# Altium project MB1361.PrjPcb (part 2 of 3)

## Sheet ST_LINK_V2-1.SchDoc: ST_LINK_V2-1
size A3; Date: Not used; ApprovedBy: Not used; CheckedBy: Not used; Author: Not used; CompanyName: STMicroelectronics; DrawnBy: Not used; Engineer: Not used; Organization: Not used; Address1: Not used; Address2: Not used; Address3: Not used; Address4: Not used; DocumentNumber: 8; Revision: Not used; SheetNumber: 8; SheetTotal: 9; CurrentTime: Not used; CurrentDate: Not used; Time: Not used; DocumentFullPathAndName: Not used; DocumentName: Not used; ModifiedDate: Not used; ImagePath: Not used; ProjectName: Not used; Application_BuildNumber: Not used
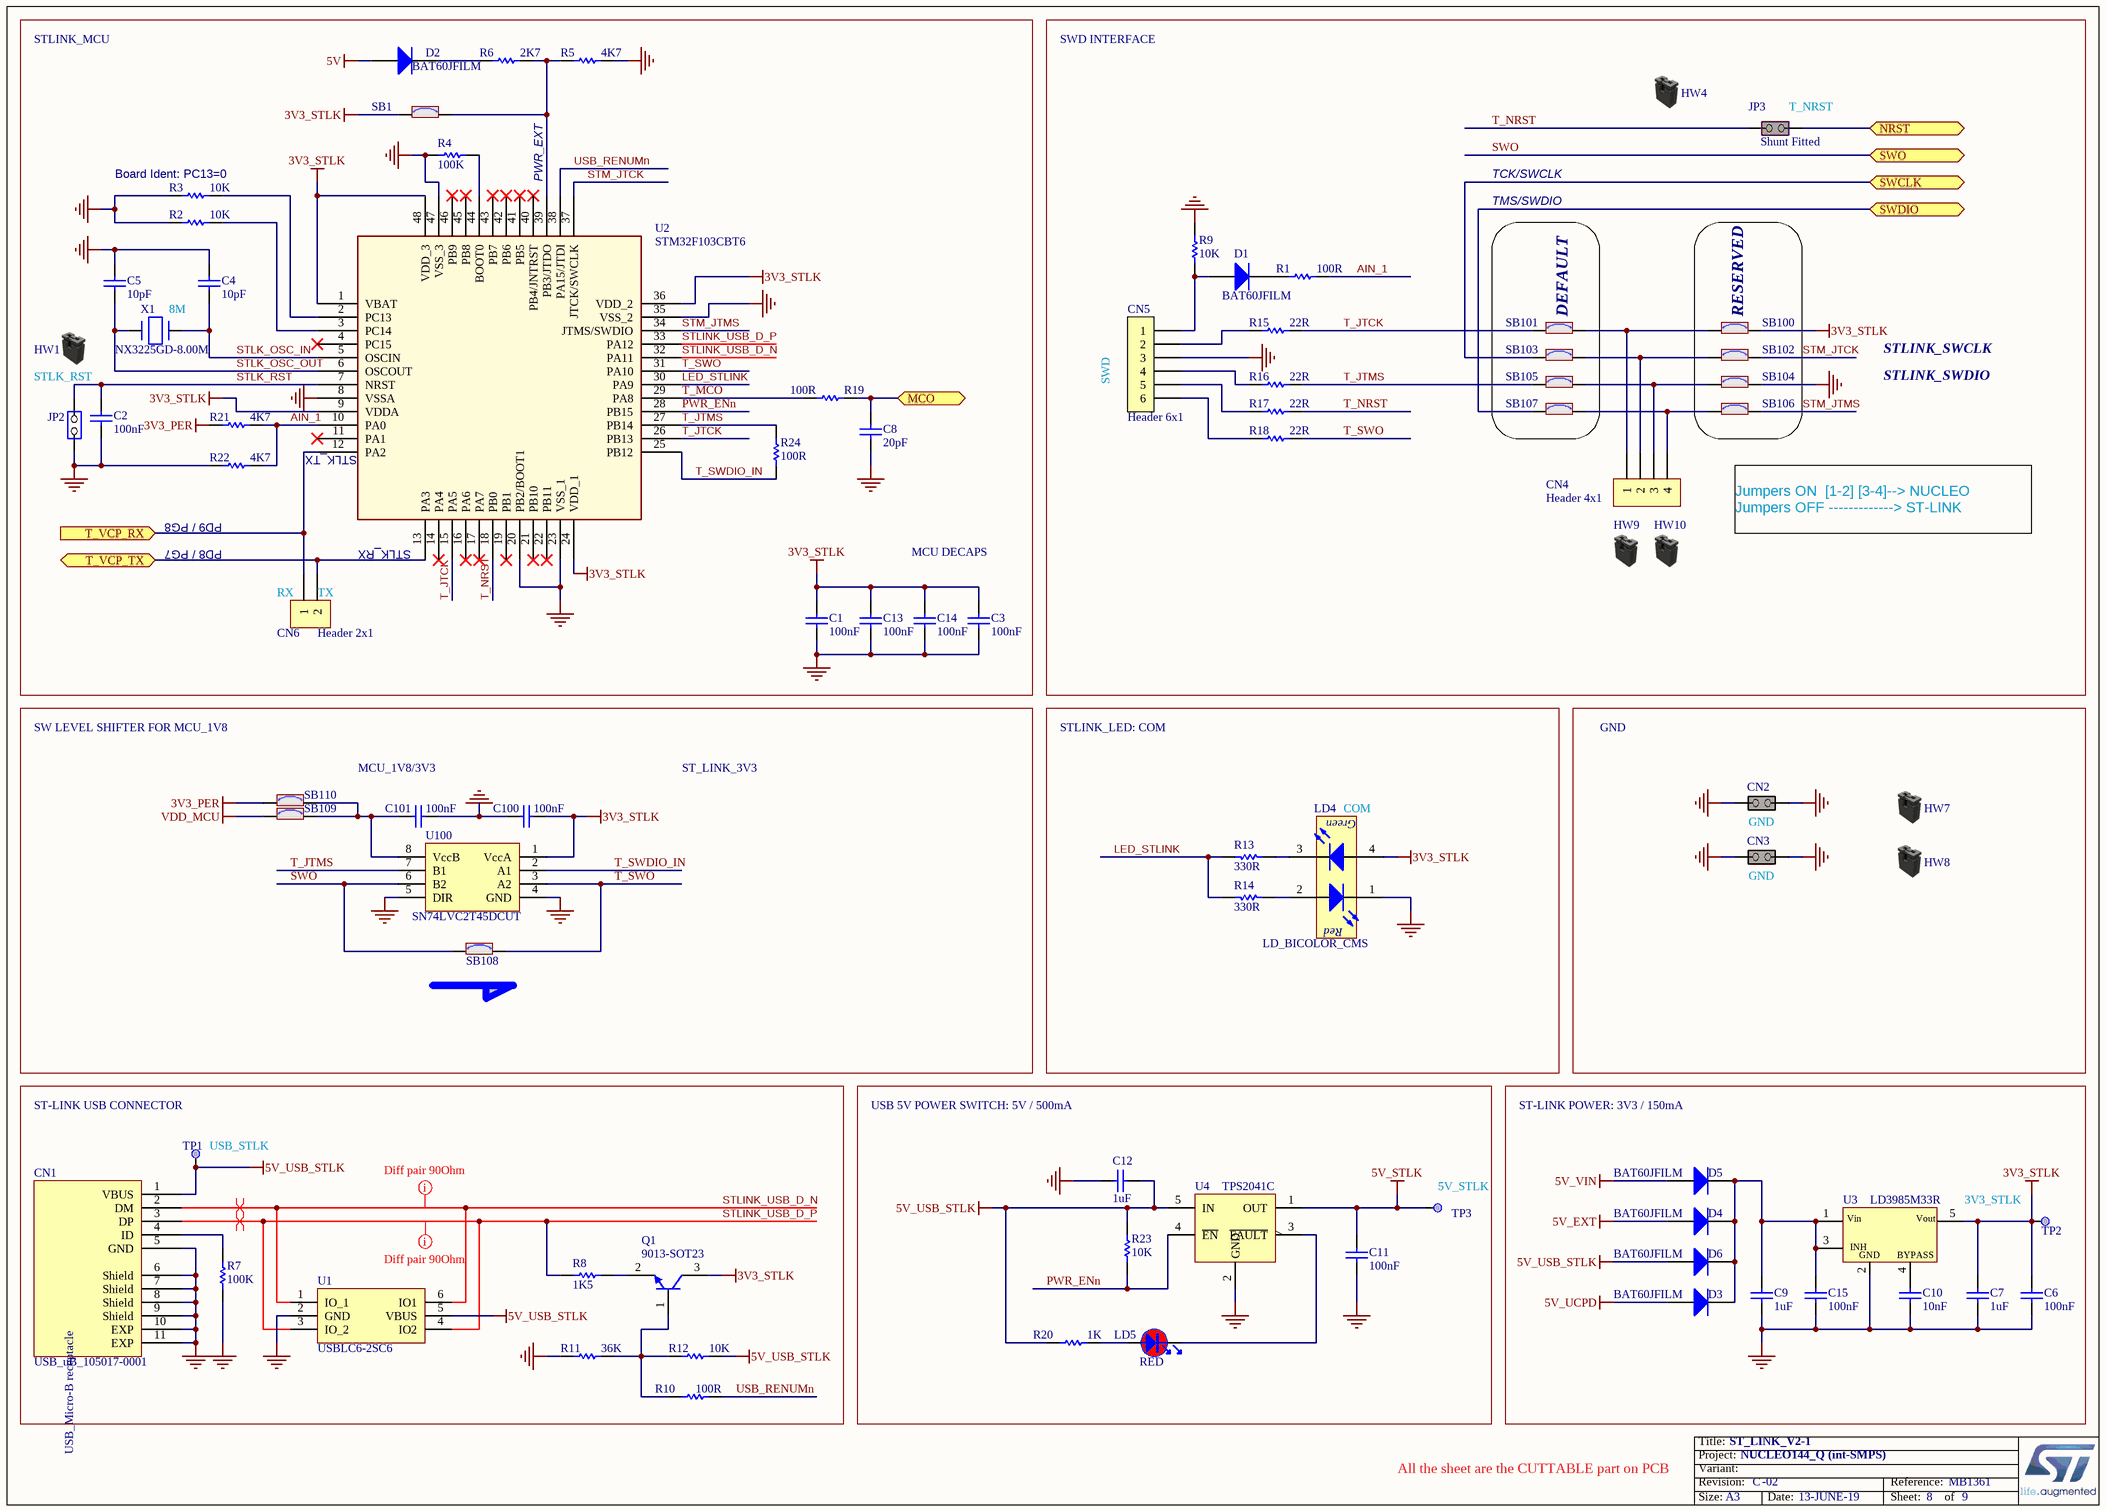
[diagram p4: ST_LINK_V2-1.SchDoc]

### Parts
C1  value 100nF  [C0603]
C2  value 100nF  [C0603]
C3  value 100nF  [C0603]
C4  value 10pF  [C0402]
C5  value 10pF  [C0402]
C6  value 100nF  [C0603]
C7  value 1uF  [C0603]  (hidden comment: Capacitor)
C8  value 20pF  [C0603]
C9  value 1uF  [C0603]
C10  value 10nF  [C0603]
C11  value 100nF  [C0603]
C12  value 1uF  [C0603]  (hidden comment: Capacitor)
C13  value 100nF  [C0603]
C14  value 100nF  [C0603]
C15  value 100nF  [C0603]
C100  value 100nF  [C0603]
C101  value 100nF  [C0603]
CN1  value USB_uB_105017-0001  [CON_USBMICROB_MOLEX_105017-0001_H2P90]
CN2  (no value)  [CON_SAMTEC_TSW-102-09-X-S]
CN3  (no value)  [CON_SAMTEC_TSW-102-09-X-S]
CN4  Header 4x1  [CON_SAMTEC_TSW-104-07-G-S]
CN5  value Header 6x1  [CON_SAMTEC_TSW-106-07-X-S]
CN6  value Header 2x1  [CON_SAMTEC_TSW-102-07-G-S]
D1  value BAT60JFILM  [DIO_SOD323]
D2  value BAT60JFILM  [DIO_SOD323]
D3  value BAT60JFILM  [DIO_SOD323]
D4  value BAT60JFILM  [DIO_SOD323]
D5  value BAT60JFILM  [DIO_SOD323]
D6  value BAT60JFILM  [DIO_SOD323]
HW1  (no value)  (mechanical)
HW4  (no value)  (mechanical)
HW7  (no value)  (mechanical)
HW8  (no value)  (mechanical)
HW9  (no value)  (mechanical)
HW10  (no value)  (mechanical)
JP2  (no value)  [CON_SAMTEC_TSW-102-07-G-S]
JP3  value Shunt Fitted  [CON_SAMTEC_TSW-102-07-G-S]
LD4  value LD_BICOLOR_CMS  [LED_BI-GR_HSMF-A201-A00J1]
LD5  value RED  [LED_0603_RED_H0P4]
Q1  value 9013-SOT23  [NPN_SOT23]
R1  value 100R  [R0603]
R2  value 10K  [R0603]
R3  value 10K  [R0603]
R4  value 100K  [R0603]
R5  value 4K7  [R0603]
R6  value 2K7  [R0603]
R7  value 100K  [R0603]
R8  value 1K5  [R0603]
R9  value 10K  [R0603]
R10  value 100R  [R0603]
R11  value 36K  [R0603]
R12  value 10K  [R0603]
R13  value 330R  [R0603]
R14  value 330R  [R0603]
R15  value 22R  [R0603]
R16  value 22R  [R0603]
R17  value 22R  [R0603]
R18  value 22R  [R0603]
R19  value 100R  [R0603]
R20  value 1K  [R0603]
R21  value 4K7  [R0603]
R22  value 4K7  [R0603]
R23  value 10K  [R0603]
R24  value 100R  [R0603]
SB1  (no value)  [SOLDER-BRIDGE_R0603-0R]
SB100  (no value)  [SOLDER-BRIDGE_R0603-0R]
SB101  (no value)  [SOLDER-BRIDGE_R0603-0R]
SB102  (no value)  [SOLDER-BRIDGE_R0603-0R]
SB103  (no value)  [SOLDER-BRIDGE_R0603-0R]
SB104  (no value)  [SOLDER-BRIDGE_R0603-0R]
SB105  (no value)  [SOLDER-BRIDGE_R0603-0R]
SB106  (no value)  [SOLDER-BRIDGE_R0603-0R]
SB107  (no value)  [SOLDER-BRIDGE_R0603-0R]
SB108  (no value)  [SOLDER-BRIDGE_R0603-0R]
SB109  (no value)  [SOLDER-BRIDGE_R0603-0R]
SB110  (no value)  [SOLDER-BRIDGE_R0603-0R]
TP1  (no value)  [TP_SMD_1MM]  (no BOM)
TP2  (no value)  [TP_SMD_1MM]  (no BOM)
TP3  (no value)  [TP_SMD_1MM]  (no BOM)
U1  value USBLC6-2SC6  [ESD_SOT23-6L]
U2  value STM32F103CBT6  [ICC_LQFP48_7X7_P050]
U3  value LD3985M33R  [REG_SOT23-5L]
U4  TPS2041C  [MOS_SOT23-5L]
U100  value SN74LVC2T45DCUT  [ICC_VSSOP8_DCU_R-PDSO-G8_2X2P30_P050]
X1  value NX3225GD-8.00M  [CRY_NX3225GD_2P]

### Blocks framed on the sheet
DEFAULT: SB101 SB103 SB105 SB107
RESERVED: SB100 SB102 SB104 SB106

### Ports
MCO, NRST, SWCLK, SWDIO, SWO, T_VCP_RX (in), T_VCP_TX

### Nets
3V3_PER: R21.1 SB110.2
3V3_STLK: C1.2 C3.2 C6.2 C7.2 C13.2 C14.2 C100.2 LD4.4(YellowGreen_anode) Q1.3(C) SB1.1 SB100.2 TP2.1 U2.1(VBAT) U2.9(VDDA) U2.24(VDD_1) U2.36(VDD_2) U2.48(VDD_3) U3.5(Vout) U100.1(VccA)
5V: D2.1(A)
5V_EXT: D4.1(A)
5V_STLK: C11.2 TP3.1 U4.1(OUT)
5V_UCPD: D3.1(A)
5V_USB_STLK: C12.2 CN1.1(VBUS) D6.1(A) R12.1 R20.1 R23.1 TP1.1 U1.5(VBUS) U4.5(IN)
5V_VIN: D5.1(A)
GND: C1.1 C2.1 C3.1 C4.2 C5.2 C6.1 C7.1 C8.2 C9.1 C10.1 C11.1 C12.1 C13.1 C14.1 C15.1 C100.1 C101.2 CN1.5(GND) CN1.6(Shield) CN1.7(Shield) CN1.8(Shield) CN1.9(Shield) CN1.10(EXP) CN1.11(EXP) CN2.1(COMMON) CN2.2(NO) CN3.1(COMMON) CN3.2(NO) CN5.3 JP2.1(COMMON) LD4.1(RED_cathode) R2.1 R3.1 R4.1 R5.2 R7.1 R9.2 R11.1 R22.1 SB104.2 U1.2(GND) U2.8(VSSA) U2.20(PB2/BOOT1) U2.23(VSS_1) U2.35(VSS_2) U2.47(VSS_3) U3.2(GND) U4.2(GND) U100.4(GND) U100.5(DIR)
VDD_MCU: SB109.2
AIN_1: R1.2 R21.2 R22.2 U2.10(PA0)
LED_STLINK: R13.2 R14.2 U2.30(PA9)
MCO: C8.1 R19.2 ; port MCO
NRST: JP3.2(NO) ; port NRST
PA13: SB107.1 ; port SWDIO
PA14: SB103.1 ; port SWCLK
PWR_ENn: R23.2 U2.28(PB15) U4.4(~{EN})
STLINK_USB_D_N: CN1.2(DM) U1.1(IO_1) U1.6(IO1) U2.32(PA11)
STLINK_USB_D_P: CN1.3(DP) R8.2 U1.3(IO_2) U1.4(IO2) U2.33(PA12)
STLK_OSC_IN: C4.1 U2.5(OSCIN) X1.1(X1)
STLK_OSC_OUT: C5.1 U2.6(OSCOUT) X1.2(X2)
STLK_RST: C2.2 JP2.2(NO) U2.7(NRST)
STM_JTCK: SB102.2 U2.37(JTCK/SWCLK)
STM_JTMS: SB106.2 U2.34(JTMS/SWDIO)
SWO: SB108.2 U100.6(B2) ; port SWO
T_JTCK: R15.2 SB101.1 U2.15(PA5) U2.26(PB13)
T_JTMS: R16.2 R24.2 SB105.1 U2.27(PB14) U100.7(B1)
T_MCO: R19.1 U2.29(PA8)
T_NRST: JP3.1(COMMON) R17.2 U2.18(PB0)
T_SWDIO_IN: R24.1 U2.25(PB12) U100.2(A1)
T_SWO: R18.2 SB108.1 U2.31(PA10) U100.3(A2)
T_VCP_RX: CN6.1 U2.12(PA2) ; port T_VCP_RX
T_VCP_TX: CN6.2 U2.13(PA3) ; port T_VCP_TX
USB_RENUMn: R10.2 U2.38(PA15/JTDI)
NetC9_2: C9.2 C15.2 D3.2(K) D4.2(K) D5.2(K) D6.2(K) U3.1(Vin) U3.3(CE)
NetC10_2: C10.2 U3.4(BYPASS)
NetC101_1: C101.1 SB109.1 SB110.1 U100.8(VccB)
NetCN1_4: CN1.4(ID) R7.2
NetCN4_1: CN4.1 SB100.1 SB101.2
NetCN4_2: CN4.2 SB102.1 SB103.2
NetCN4_3: CN4.3 SB104.1 SB105.2
NetCN4_4: CN4.4 SB106.1 SB107.2
NetCN5_1: CN5.1 D1.1(A) R9.1
NetCN5_2: CN5.2 R15.1
NetCN5_4: CN5.4 R16.1
NetCN5_5: CN5.5 R17.1
NetCN5_6: CN5.6 R18.1
NetD1_2: D1.2(K) R1.1
NetD2_2: D2.2(K) R6.1
NetLD4_2: LD4.2(Red_anode) R14.1
NetLD4_3: LD4.3(YellowGreen_cathode) R13.1
NetLD5_1: LD5.1 R20.2
NetLD5_2: LD5.2 U4.3(~{FAULT})
NetQ1_1: Q1.1(B) R10.1 R11.2 R12.2
NetQ1_2: Q1.2(E) R8.1
NetR2_2: R2.2 U2.3(PC14)
NetR3_2: R3.2 U2.2(PC13)
NetR4_2: R4.2 U2.44(BOOT0)
NetR5_1: R5.1 R6.2 SB1.2 U2.39(PB3/JTDO)

Not connected (* = marked no-connect by the designer): U2 4(PC15)* 11(PA1)* 14(PA4)* 16(PA6)* 17(PA7)* 19(PB1)* 21(PB10)* 22(PB11)* 40(PB4/JNTRST)* 41(PB5)* 42(PB6)* 43(PB7)* 45(PB8)* 46(PB9)*

### Layout directives
mark named Diff pair 90Ohm: STLINK_USB_D_N, STLINK_USB_D_P
differential pair: STLINK_USB_D_N, STLINK_USB_D_P

### Notes on the sheet
- STLINK_MCU
- SWD INTERFACE
- (near JP3) T_NRST
- (near R3) Board Ident: PC13=0
- PWR_EXT
- TCK/SWCLK
- TMS/SWDIO
- (near X1) 8M
- STLK_RST
- (near CN5) SWD
- STLINK_SWCLK
- STLINK_SWDIO
- (near U2) STLK_TX
- PD9 / PG8
- PD8 / PG7
- (near U2) STLK_RX
- MCU DECAPS
- Jumpers ON  [1-2] [3-4]--> NUCLEO
  Jumpers OFF -------------> ST-LINK
- (near CN6) RX
- (near CN6) TX
- SW LEVEL SHIFTER FOR MCU_1V8
- MCU_1V8/3V3
- ST_LINK_3V3
- STLINK_LED: COM
- GND
- (near LD4) COM
- (near CN2) GND
- (near CN3) GND
- ST-LINK USB CONNECTOR
- USB 5V POWER SWITCH: 5V / 500mA
- ST-LINK POWER: 3V3 / 150mA
- (near TP1) USB_STLK
- (near TP3) 5V_STLK
- 3V3_STLK
- All the sheet are the CUTTABLE part on PCB
- Title:
- Project:
- Size:
- Revision:
- Variant:
- A3
- -
- Date:
- Reference:
- Sheet:
- of
- (in symbol MCD-00028) USB_Micro-B receptacle
- (in symbol MCD-00051) Green; Red
- (in symbol MCD-00086) INH

### Library data of the parts
C1-C3 C6 C11 C13-C15 C100 C101 = MCD-00211: as C120 on sheet STM32_microcontroller_IOs; Internal_Part_Number: MCD-00211; ECCN_US: n/a; ECCN_EU: n/a; ComponentLink1Description: Datasheet; Status: Released; Part_Type: Capacitor; Package: C0603; ComponentLink1URL: http://tunmcdsvn.tun.st.com/Component_Datasheet_Library/Trunk/Capacitors/Yageo_Multilayer_Capacitor_X7R_series_100pF_to_22uF
C4 C5 = MCD-00015: Capacitor, MLCC, 10pF, 50V, NPO, 5%, 0402, T=0,5mm; Manufacturer_Part_Number: CC0402JRNPO9BN100; Manufacturer: YAGEO; Provided_By: subcon; Initial_Board_Reference: MB1274; Internal_Part_Number: MCD-00015; ECCN_US: n/a; ECCN_EU: n/a; ComponentLink1Description: Datasheet; Status: Released; Part_Type: Capacitor; Package: C0402; ComponentLink1URL: http://tunmcdsvn.tun.st.com/Component_Datasheet_Library/Trunk/Capacitors/Yageo_Capacitor_NP0_16V-to-50V
C7 C12 = MCD-00010: Capacitor, MLCC, 1uF, 16V, X5R, 10%, 0603, T=0,8mm; Manufacturer_Part_Number: CC0603KRX5R7BB105; Manufacturer: YAGEO; Provided_By: SUBCO; Internal_Part_Number: MCD-00010; Status: Released; Part_Type: Capacitor; Package: C0603; ComponentLink1Description: Datasheet; ComponentLink1URL: http://tunmcdsvn.tun.st.com/Component_Datasheet_Library/Trunk/Capacitors/Yageo_Multilayer_capacitor_X5R_series_100pF_to_100uF
C8 = MCD-00638: Capacitor, MLCC, 20pF, 50V, NPO, 5%, 0603, T=0,8mm; Manufacturer_Part_Number: CC0603JRNPO9BN200; Manufacturer: YAGEO; Provided_By: Subcon; Initial_Board_Reference: MB1319; Internal_Part_Number: MCD-00638; Status: Released; Part_Type: Capacitor; Package: C0603; ComponentLink1Description: Datasheet; ECCN_US: n/a; ECCN_EU: n/a; ComponentLink1URL: http://tunmcdsvn.tun.st.com/Component_Datasheet_Library/Trunk/Capacitors/Yageo_Capacitor_NP0_16V-to-50V
C9 = MCD-00010: Capacitor, MLCC, 1uF, 16V, X5R, 10%, 0603, T=0,8mm; Manufacturer_Part_Number: CC0603KRX5R7BB105; Manufacturer: YAGEO; Provided_By: Subcon; Initial_Board_Reference: MB1274; Internal_Part_Number: MCD-00010; ECCN_US: n/a; ECCN_EU: n/a; ComponentLink1Description: Datasheet; Status: Released; Part_Type: Capacitor; Package: C0603; ComponentLink1URL: http://tunmcdsvn.tun.st.com/Component_Datasheet_Library/Trunk/Capacitors/Yageo_Multilayer_capacitor_X5R_series_100pF_to_100uF
C10 = MCD-00017: Capacitor, MLCC, 10nF, 50V, X7R, 10%, 0603, T=0.8mm; Manufacturer_Part_Number: CC0603KRX7R9BB103; Manufacturer: YAGEO; Provided_By: Subcon; Initial_Board_Reference: MB1274; Internal_Part_Number: MCD-00017; ECCN_US: n/a; ECCN_EU: n/a; ComponentLink1Description: Datasheet; Status: Released; Part_Type: Capacitor; Package: C0603; ComponentLink1URL: http://tunmcdsvn.tun.st.com/Component_Datasheet_Library/Trunk/Capacitors/Yageo_Multilayer_Capacitor_X7R_series_100pF_to_22uF
CN1 = MCD-00028: USB-MICRO-B, 0.65mm, RA, SMT, Bottom Mount,; Manufacturer_Part_Number: 1050170001; Manufacturer: MOLEX; Part_Type: Connector; Provided_By: Subcon; Initial_Board_Reference: MB1274; Internal_Part_Number: MCD-00028; ECCN_US: n/a; ECCN_EU: n/a; ComponentLink1Description: Datasheet; Status: Released; ComponentLink1URL: http://tunmcdsvn.tun.st.com/Component_Datasheet_Library/Trunk/Connectors/Molex_Connector-USB-microB_105017-0001
CN2 CN3 = MCD-00214: Header, 2x1, 2,54mm, VR, TH, Height 5.84mm/10.16mm; Manufacturer_Part_Number: TSW-102-09-x-S; Manufacturer: SAMTEC; Part_Type: Connector; Value: Header 2x1 16mm; Provided_By: Subcon; Initial_Board_Reference: MB1319; Internal_Part_Number: MCD-00214; ECCN_US: n/a; ECCN_EU: n/a; ComponentLink1Description: Datasheet; Status: Released; ComponentLink1URL: http://tunmcdsvn.tun.st.com/Component_Datasheet_Library/Trunk/Connectors/Samtec_TSW-HTSW-series
CN4 = MCD-00029: Header, 4x1, 2,54mm, VR, TH, Height 5.84mm/2.54mm; Part_Type: Connector; Manufacturer_Part_Number: TSW-104-07-x-S; Manufacturer: SAMTEC; Provided_By: SUBCO; Initial_Board_Reference: MB1274; Path: ws/MCD_ApplicationBoards/Lists/MCDPARTSdatabase; Item Type: Item; Internal_Part_Number: MCD-00029; Value: Header 4x1; Status: Released; ComponentLink1Description: Datasheet; ComponentLink1URL: http://tunmcdsvn.tun.st.com/Component_Datasheet_Library/Trunk/Connectors/Samtec_TSW-HTSW-series
CN5 = MCD-00212: Header, 6x1, 2,54mm, VR, TH, Height 5.84mm/2.54mm; Manufacturer_Part_Number: TSW-106-07-x-S; Manufacturer: SAMTEC; Part_Type: Connector; Provided_By: Subcon; Initial_Board_Reference: MB1319; Internal_Part_Number: MCD-00212; ECCN_US: n/a; ECCN_EU: n/a; ComponentLink1Description: Datasheet; Status: Released; ComponentLink1URL: http://tunmcdsvn.tun.st.com/Component_Datasheet_Library/Trunk/Connectors/Samtec_TSW-HTSW-series
CN6 = MCD-00032: Header, 2x1, 2,54mm, VR, TH, Height 5.84mm/2.54mm; Manufacturer_Part_Number: TSW-102-07-x-S; Manufacturer: SAMTEC; Part_Type: Connector; Provided_By: Subcon; Initial_Board_Reference: MB1274; Internal_Part_Number: MCD-00032; ECCN_US: n/a; ECCN_EU: n/a; ComponentLink1Description: Datasheet; Status: Released; ComponentLink1URL: http://tunmcdsvn.tun.st.com/Component_Datasheet_Library/Trunk/Connectors/Samtec_TSW-HTSW-series
D1-D6 = MCD-00034: BAT60JFILM; Manufacturer: STMICROELECTRONICS; Part_Type: Diode; ECCN_US: EAR99; ECCN_EU: NEC; Provided_By: Subcon; Initial_Board_Reference: MB1274; Internal_Part_Number: MCD-00034; Manufacturer_Part_Number: BAT60JFILM; ComponentLink1Description: Datasheet; Status: Released; ComponentLink1URL: http://tunmcdsvn.tun.st.com/Component_Datasheet_Library/Trunk/Diodes/STM_Diode_BAT60JFILM-SOD323
HW1 HW4 HW7-HW10 = MCD-00043: SHUNT 2.54mm BLACK; Manufacturer_Part_Number: SNT-100-BK-G; Manufacturer: SAMTEC; Part_Type: Mechanical; Provided_By: Subcon; Initial_Board_Reference: MB1274; Internal_Part_Number: MCD-00043; ECCN_US: n/a; ECCN_EU: n/a; ComponentLink1Description: Datasheet; Status: Released; ComponentLink1URL: http://tunmcdsvn.tun.st.com/Component_Datasheet_Library/Trunk/Connectors/Samtec_Shunt_Jumper_SNT100
JP2 = MCD-00045: Header, 2x1, 2,54mm, VR, TH, Height 5.84mm/2.54mm; Manufacturer_Part_Number: TSW-102-07-x-S; Manufacturer: SAMTEC; Part_Type: Connector; Value: Shunt not fitted; Provided_By: Subcon; Initial_Board_Reference: MB1274; Remark: 3D KO: BZ: 40098; Internal_Part_Number: MCD-00045; ECCN_US: n/a; ECCN_EU: n/a; ComponentLink1Description: Datasheet; Status: Footprint available; ComponentLink1URL: http://tunmcdsvn.tun.st.com/Component_Datasheet_Library/Trunk/Connectors/Samtec_TSW-HTSW-series
JP3 = MCD-00683: Header, 2x1, 2,54mm, VR, TH, Height 5.84mm/2.54mm - Shunt Fitted by default; Part_Type: Connector; Manufacturer_Part_Number: TSW-102-07-x-S; Manufacturer: SAMTEC; Provided_By: Subcon; Initial_Board_Reference: MB1331; Internal_Part_Number: MCD-00683; Status: Released; ComponentLink1Description: Datasheet; ComponentLink1URL: http://tunmcdsvn.tun.st.com/Component_Datasheet_Library/Trunk/Connectors/Samtec_TSW-HTSW-series; ECCN_US: n/a; ECCN_EU: n/a; Remark: Shunt Fitted
LD4 = MCD-00051: LED Bicolor; Manufacturer_Part_Number: HSMF-A201-A00J1; Manufacturer: AVAGO TECHNOLOGIES; Alternate_Manufacturer_Part_Number: LE-RGW35280; Alternate_Manufacturer: EVERLUCK; Part_Type: Display; ECCN_US: EAR99; ECCN_EU: NEC; Provided_By: Subcon; Initial_Board_Reference: MB1274; Internal_Part_Number: MCD-00051; ComponentLink1Description: Datasheet; Status: Released; ComponentLink1URL: http://tunmcdsvn.tun.st.com/Component_Datasheet_Library/Trunk/Display/Avago_LED-SMC_HSMx-A2xx-02Feb2012
LD5 = MCD-00322: LED, Red, 0603; Part_Type: Display; Manufacturer_Part_Number: 19-217/R6C-AL1M2VY/3T; Manufacturer: EVERLIGHT; ECCN_US: EAR99; ECCN_EU: NEC; Provided_By: Subcon; Initial_Board_Reference: MB1311; Internal_Part_Number: MCD-00322; Status: Released; Package: LED 0603; ComponentLink1Description: Datasheet; ComponentLink1URL: http://tunmcdsvn.tun.st.com/Component_Datasheet_Library/Trunk/Display/Everlight_SMD-LED-RED_19-213-R6C-AP1Q2B-3T-V3.doc
Q1 = MCD-00073: NPN Bipolar Transistor; Manufacturer_Part_Number: BSR14; Manufacturer: NXP; Part_Type: IC; ECCN_US: EAR99; ECCN_EU: NEC; Provided_By: Subcon; Initial_Board_Reference: MB1274; Revision: *; Internal_Part_Number: MCD-00073; ComponentLink1Description: Datasheet; Status: Released; ComponentLink1URL: http://tunmcdsvn.tun.st.com/Component_Datasheet_Library/Trunk/IC/NXP_Transistor_BSR14
R1 R10 R19 R24 = MCD-00224: Resistor,100R,0603,1%,1/10W; Manufacturer_Part_Number: RC0603FR-07100RL; Manufacturer: YAGEO; Provided_By: Subcon; Initial_Board_Reference: MB1319; Internal_Part_Number: MCD-00224; ECCN_US: n/a; ECCN_EU: n/a; ComponentLink1Description: Datasheet; Status: Released; Part_Type: Resistor; Package: R0603; ComponentLink1URL: http://tunmcdsvn.tun.st.com/Component_Datasheet_Library/Trunk/Resistors/Yageo_Resistor_RC0603-series
R2 R3 R9 R12 R23 = MCD-00220: Resistor,10K,0603,1%,1/10W; Manufacturer_Part_Number: RC0603FR-0710KL; Manufacturer: YAGEO; Provided_By: Subcon; Initial_Board_Reference: MB1319; Internal_Part_Number: MCD-00220; ECCN_US: n/a; ECCN_EU: n/a; ComponentLink1Description: Datasheet; Status: Released; Part_Type: Resistor; Package: R0603; ComponentLink1URL: http://tunmcdsvn.tun.st.com/Component_Datasheet_Library/Trunk/Resistors/Yageo_Resistor_RC0603-series
R4 R7 = MCD-00223: as R39 on sheet STM32_microcontroller_IOs; Internal_Part_Number: MCD-00223; ECCN_US: n/a; ECCN_EU: n/a; ComponentLink1Description: Datasheet; Status: Released; Part_Type: Resistor; Package: R0603; ComponentLink1URL: http://tunmcdsvn.tun.st.com/Component_Datasheet_Library/Trunk/Resistors/Yageo_Resistor_RC0603-series
R5 R21 R22 = MCD-00219: Resistor,4K7,0603,1%,1/10W; Manufacturer_Part_Number: RC0603FR-074K7L; Manufacturer: YAGEO; Provided_By: Subcon; Initial_Board_Reference: MB1319; Internal_Part_Number: MCD-00219; ECCN_US: n/a; ECCN_EU: n/a; ComponentLink1Description: Datasheet; Status: Released; Part_Type: Resistor; Package: R0603; ComponentLink1URL: http://tunmcdsvn.tun.st.com/Component_Datasheet_Library/Trunk/Resistors/Yageo_Resistor_RC0603-series
R6 = MCD-00218: Resistor,2K7,0603,1%,1/10W; Manufacturer_Part_Number: RC0603FR-072K7L; Manufacturer: YAGEO; Provided_By: Subcon; Initial_Board_Reference: MB1319; Internal_Part_Number: MCD-00218; ECCN_US: n/a; ECCN_EU: n/a; ComponentLink1Description: Datasheet; Status: Released; Part_Type: Resistor; Package: R0603; ComponentLink1URL: http://tunmcdsvn.tun.st.com/Component_Datasheet_Library/Trunk/Resistors/Yageo_Resistor_RC0603-series
R8 = MCD-00217: Resistor,1K5,0603,1%,1/10W; Manufacturer_Part_Number: RC0603FR-071K5L; Manufacturer: YAGEO; Provided_By: Subcon; Initial_Board_Reference: MB1319; Internal_Part_Number: MCD-00217; ECCN_US: n/a; ECCN_EU: n/a; ComponentLink1Description: Datasheet; Status: Released; Part_Type: Resistor; Package: R0603; ComponentLink1URL: http://tunmcdsvn.tun.st.com/Component_Datasheet_Library/Trunk/Resistors/Yageo_Resistor_RC0603-series
R11 = MCD-00221: Resistor,36K,0603,1%,1/10W; Manufacturer_Part_Number: RC0603FR-0736KL; Manufacturer: YAGEO; Provided_By: Subcon; Initial_Board_Reference: MB1319; Internal_Part_Number: MCD-00221; ECCN_US: n/a; ECCN_EU: n/a; ComponentLink1Description: Datasheet; Status: Released; Part_Type: Resistor; Package: R0603; ComponentLink1URL: http://tunmcdsvn.tun.st.com/Component_Datasheet_Library/Trunk/Resistors/Yageo_Resistor_RC0603-series
R13 R14 = MCD-00197: Resistor,330R,0603,1%,1/10W; Manufacturer_Part_Number: RC0603FR-07330RL; Manufacturer: YAGEO; Provided_By: Subcon; Internal_Part_Number: MCD-00197; ComponentLink1Description: Datasheet; ECCN_US: n/a; ECCN_EU: n/a; Status: Released; Part_Type: Resistor; Package: R0603; ComponentLink1URL: http://tunmcdsvn.tun.st.com/Component_Datasheet_Library/Trunk/Resistors/Yageo_Resistor_RC0603-series
R15-R18 = MCD-00190: Resistor,22R,0603,1%,1/10W; Manufacturer_Part_Number: RC0603FR-0722RL; Manufacturer: YAGEO; Provided_By: Subcon; Internal_Part_Number: MCD-00190; ComponentLink1Description: Datasheet; ECCN_US: n/a; ECCN_EU: n/a; Status: Released; Part_Type: Resistor; Package: R0603; ComponentLink1URL: http://tunmcdsvn.tun.st.com/Component_Datasheet_Library/Trunk/Resistors/Yageo_Resistor_RC0603-series
R20 = MCD-00070: as R28 on sheet STM32_microcontroller_IOs; Internal_Part_Number: MCD-00070; ECCN_US: n/a; ECCN_EU: n/a; ComponentLink1Description: Datasheet; Status: Released; Part_Type: Resistor; Package: R0603; ComponentLink1URL: http://tunmcdsvn.tun.st.com/Component_Datasheet_Library/Trunk/Resistors/Yageo_Resistor_RC0603-series
SB1 SB100-SB110 = MCD-00071: as SB6 on sheet STM32_microcontroller_IOs; Internal_Part_Number: MCD-00071; ECCN_US: n/a; ECCN_EU: n/a; Status: Released; ComponentLink1Description: Datasheet
TP1-TP3 = MCD-00074: Test Point 1mm; Part_Type: Mechanical; Initial_Board_Reference: MB1274; Internal_Part_Number: MCD-00074; Value: 1mm; Status: Released; Manufacturer_Part_Number: n/a; Manufacturer: n/a; ComponentLink1Description: Datasheet; ComponentLink1URL: http://na; ECCN_US: n/a; ECCN_EU: n/a; Provided_By: n/a
U1 = MCD-00163: Very low capacitance ESD protection; Part_Type: IC; Manufacturer: STMICROELECTRONICS; ECCN_US: EAR99; ECCN_EU: NEC; Provided_By: Subcon; Initial_Board_Reference: MB1263; Internal_Part_Number: MCD-00163; Status: Released; Manufacturer_Part_Number: USBLC6-2SC6; ComponentLink1Description: Datasheet; ComponentLink1URL: http://tunmcdsvn.tun.st.com/Component_Datasheet_Library/Trunk/Diodes/STM_ESD_USBLC6-2
U2 = MCD-00085: Medium-density performance line ARM-based 32-bit MCU with 128KB Flash; Manufacturer: STMICROELECTRONICS; Part_Type: IC; ECCN_US: 3A991A2; ECCN_EU: NEC; Provided_By: Subcon; Initial_Board_Reference: MB1274; Internal_Part_Number: MCD-00085; Manufacturer_Part_Number: STM32F103CBT6; ComponentLink1Description: Datasheet; Status: Released; ComponentLink1URL: http://tunmcdsvn.tun.st.com/Component_Datasheet_Library/Trunk/IC/STM_STM32F103CBT6
U3 = MCD-00086: Ultra low drop-low noise BiCMOS voltage, regulators low ESR capacitors compatible; Manufacturer: STMICROELECTRONICS; Part_Type: IC; ECCN_US: EAR99; ECCN_EU: NEC; Provided_By: Subcon; Initial_Board_Reference: MB1274; Internal_Part_Number: MCD-00086; Manufacturer_Part_Number: LD3985M33R; ComponentLink1Description: Datasheet; Status: Released; ComponentLink1URL: http://tunmcdsvn.tun.st.com/Component_Datasheet_Library/Trunk/IC/STM_LDO_LD3985
U4 = MCD-01785: 5V Power Switch, 0.85A, RDSon 130mOhm max, with active low enable pin; Part_Type: IC; Manufacturer_Part_Number: TPS2041CDBVT; Manufacturer: TEXAS INSTRUMENTS; ECCN_US: EAR99; ECCN_EU: NEC; Provided_By: SUBCO; Internal_Part_Number: MCD-01785; Value: TPS2041C; Status: Footprint available; Package: SOT23_5p; ComponentLink1Description: Datasheet; ComponentLink1URL: http://tunmcdsvn.tun.st.com/Component_Datasheet_Library/Trunk/IC/TI_PWR_SWITCH_5V_TPS20xxC
U100 = MCD-00264: Dual bit dual supply bus transceiver; Part_Type: IC; Manufacturer: TEXAS INSTRUMENTS; ECCN_US: EAR99; ECCN_EU: NEC; Provided_By: Subcon; Initial_Board_Reference: MB1319; Internal_Part_Number: MCD-00264; Status: Released; Manufacturer_Part_Number: SN74LVC2T45DCUT; ComponentLink1Description: Datasheet; ComponentLink1URL: http://tunmcdsvn.tun.st.com/Component_Datasheet_Library/Trunk/IC/TI_Dual_bit_tranceiver_SN74LVC2T45
X1 = MCD-00092: Crystal 8Mhz, 8pF, -+50PPM, SMD; Manufacturer_Part_Number: NX3225GD 8MHz EXS00A-CG04874; Manufacturer: NDK; Part_Type: Crystal_Osc; ECCN_US: EAR99; ECCN_EU: NEC; Provided_By: STM; Initial_Board_Reference: MB1274; Internal_Part_Number: MCD-00092; ComponentLink1Description: Datasheet; Status: Released; ComponentLink1URL: http://tunmcdsvn.tun.st.com/Component_Datasheet_Library/Trunk/Crystal_Osc/NDK_Crystal-For-ST_NX3225GD 8MHz EXS00A-CG04874 (EXS10B-20725)

## Sheet Mechanical_Parts.SchDoc: Mechanical_Parts
size A4; Date: Not used; ApprovedBy: Not used; CheckedBy: Not used; Author: Not used; CompanyName: STMicroelectronics; DrawnBy: Not used; Engineer: Not used; Organization: Not used; Address1: Not used; Address2: Not used; Address3: Not used; Address4: Not used; DocumentNumber: 9; Revision: Not used; SheetNumber: 9; SheetTotal: 9; CurrentTime: Not used; CurrentDate: Not used; Time: Not used; DocumentFullPathAndName: Not used; DocumentName: Not used; ModifiedDate: Not used; ImagePath: Not used; ProjectName: Not used; Application_BuildNumber: Not used
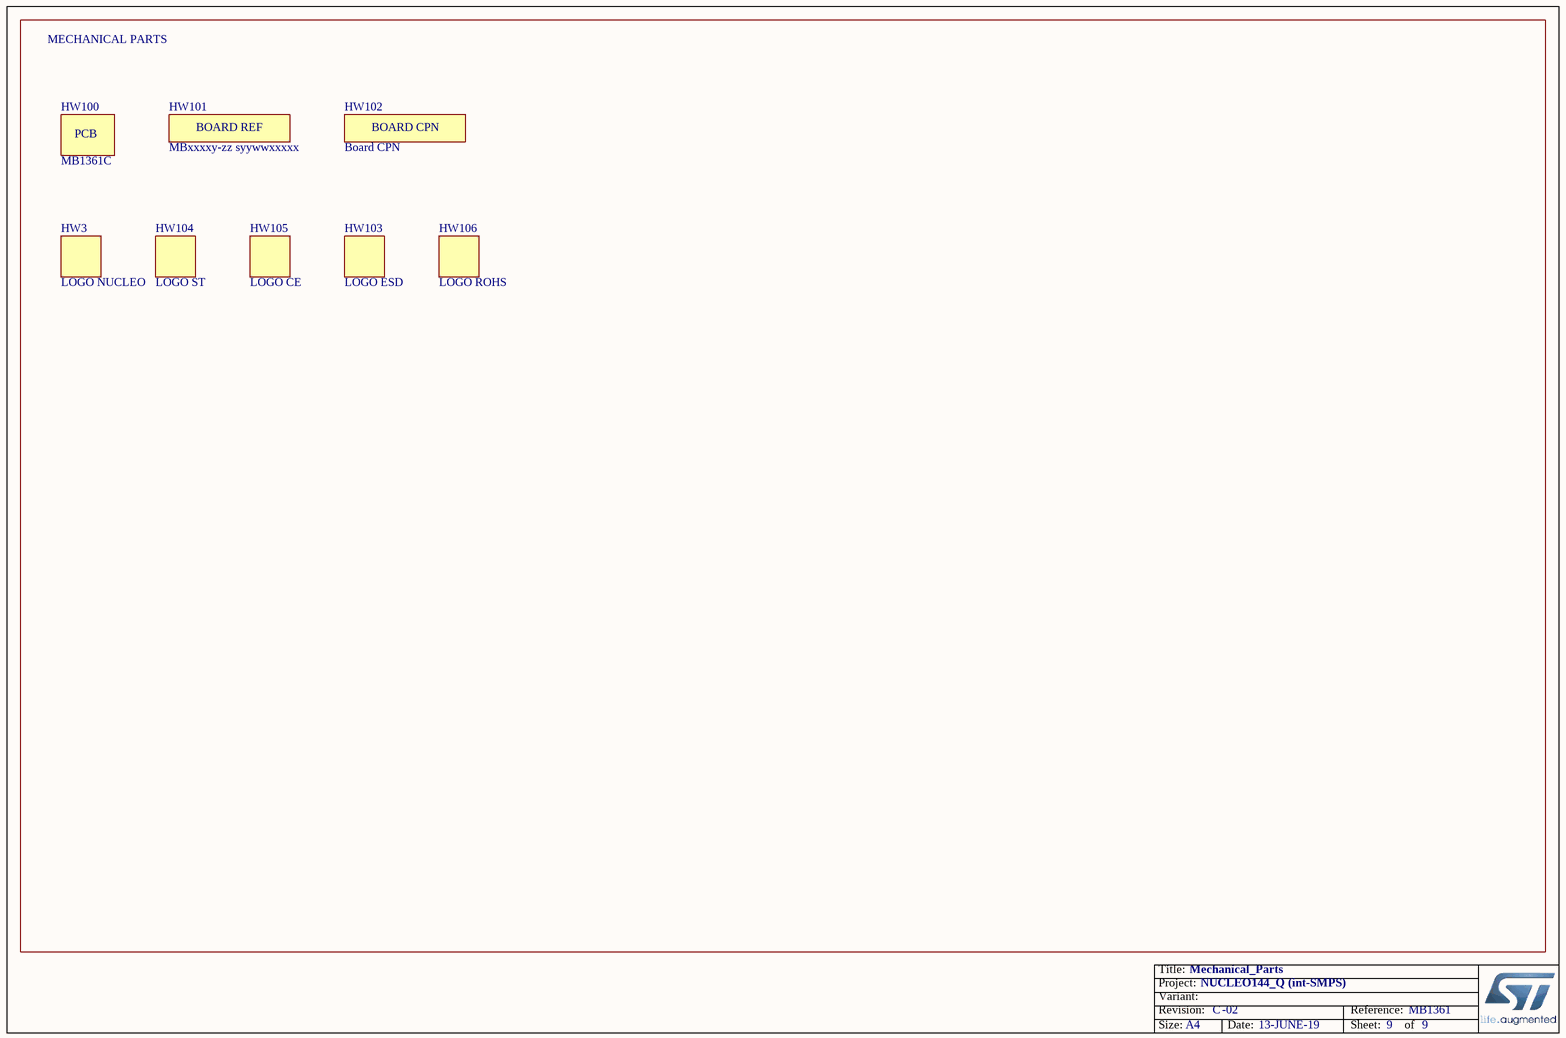
[diagram p5: Mechanical_Parts.SchDoc]

### Parts
HW3  value LOGO NUCLEO  [LOGO_NUCLEO]  (no BOM)
HW100  value MB1361C  (mechanical)
HW101  value MBxxxxy-zz syywwxxxxx  [STICKER_25X9]  (hidden comment: STICKER_BOARD_REF)  (no BOM)
HW102  value Board CPN  [STICKER_25X9]  (hidden comment: STICKER_BOARD_CPN)  (no BOM)
HW103  value LOGO ESD  [LOGO_MAIN_1]  (no BOM)
HW104  value LOGO ST  [LOGO_ST]  (no BOM)
HW105  value LOGO CE  [LOGO_CE]  (no BOM)
HW106  value LOGO ROHS  [LOGO_ROHS]  (no BOM)

### Notes on the sheet
- MECHANICAL PARTS
- Title:
- Project:
- Size:
- Revision:
- Variant:
- A4
- -
- Date:
- Reference:
- Sheet:
- of
- (in symbol MCD-00235) BOARD REF
- (in symbol MCD-00547) BOARD CPN

### Library data of the parts
HW3 = MCD-00636: NUCLEO logo footprint for PCB; Part_Type: Mechanical; Initial_Board_Reference: MB1331; Internal_Part_Number: MCD-00636; Status: Released; ECCN_US: n/a; ECCN_EU: n/a; Provided_By: n/a; ComponentLink1Description: Datasheet
HW100 = MCD-00216: PCB, xxxx for PCB ref, Y for revision; Part_Type: Mechanical; Provided_By: Subcon; Initial_Board_Reference: MB1319; Internal_Part_Number: MCD-00216; Status: Released; ECCN_US: n/a; ECCN_EU: n/a; ComponentLink1Description: Datasheet
HW101 = MCD-00235: Sticker to mention board reference + serial number; Part_Type: Mechanical; Provided_By: SUBCO; Internal_Part_Number: MCD-00235; Status: Released; Manufacturer_Part_Number: n/a; Manufacturer: n/a; ComponentLink1Description: Datasheet; ComponentLink1URL: n/a
HW102 = MCD-00547: Sticker to mention board CPN code; Part_Type: Mechanical; Provided_By: SUBCO; Internal_Part_Number: MCD-00547; Status: Released; Manufacturer_Part_Number: n/a; Manufacturer: n/a; ComponentLink1Description: Datasheet; ComponentLink1URL: NA
HW103 = MCD-00627: Hand ESD logo footprint for PCB; Part_Type: Mechanical; Initial_Board_Reference: MB1331; Internal_Part_Number: MCD-00627; Status: Released; ECCN_US: n/a; ECCN_EU: n/a; Provided_By: n/a; Manufacturer_Part_Number: n/a; Manufacturer: n/a; ComponentLink1Description: Datasheet; ComponentLink1URL: http://na
HW104 = MCD-00625: STMicroelectronics logo footprint for PCB; Part_Type: Mechanical; Initial_Board_Reference: MB1331; Internal_Part_Number: MCD-00625; Status: Released; ECCN_US: n/a; ECCN_EU: n/a; Provided_By: n/a; Manufacturer_Part_Number: n/a; Manufacturer: n/a; ComponentLink1Description: Datasheet; ComponentLink1URL: http://na
HW105 = MCD-00626: CE logo footprint for PCB; Part_Type: Mechanical; Initial_Board_Reference: MB1331; Internal_Part_Number: MCD-00626; Status: Released; ECCN_US: n/a; ECCN_EU: n/a; Provided_By: n/a; ComponentLink1Description: Datasheet
HW106 = MCD-00628: ROHS logo footprint for PCB; Part_Type: Mechanical; Initial_Board_Reference: MB1331; Internal_Part_Number: MCD-00628; Status: Released; ECCN_US: n/a; ECCN_EU: n/a; Provided_By: n/a; ComponentLink1Description: Datasheet

## Sheet ARDUINO_extension_connectors.SchDoc: ARDUINO_extension_connectors
size A3; Date: Not used; ApprovedBy: Not used; CheckedBy: Not used; Author: Not used; CompanyName: STMicroelectronics; DrawnBy: Not used; Engineer: Not used; Organization: Not used; Address1: Not used; Address2: Not used; Address3: Not used; Address4: Not used; DocumentNumber: 5; Revision: Not used; SheetNumber: 5; SheetTotal: 9; CurrentTime: Not used; CurrentDate: Not used; Time: Not used; DocumentFullPathAndName: Not used; DocumentName: Not used; ModifiedDate: Not used; ImagePath: Not used; ProjectName: Not used; Application_BuildNumber: Not used
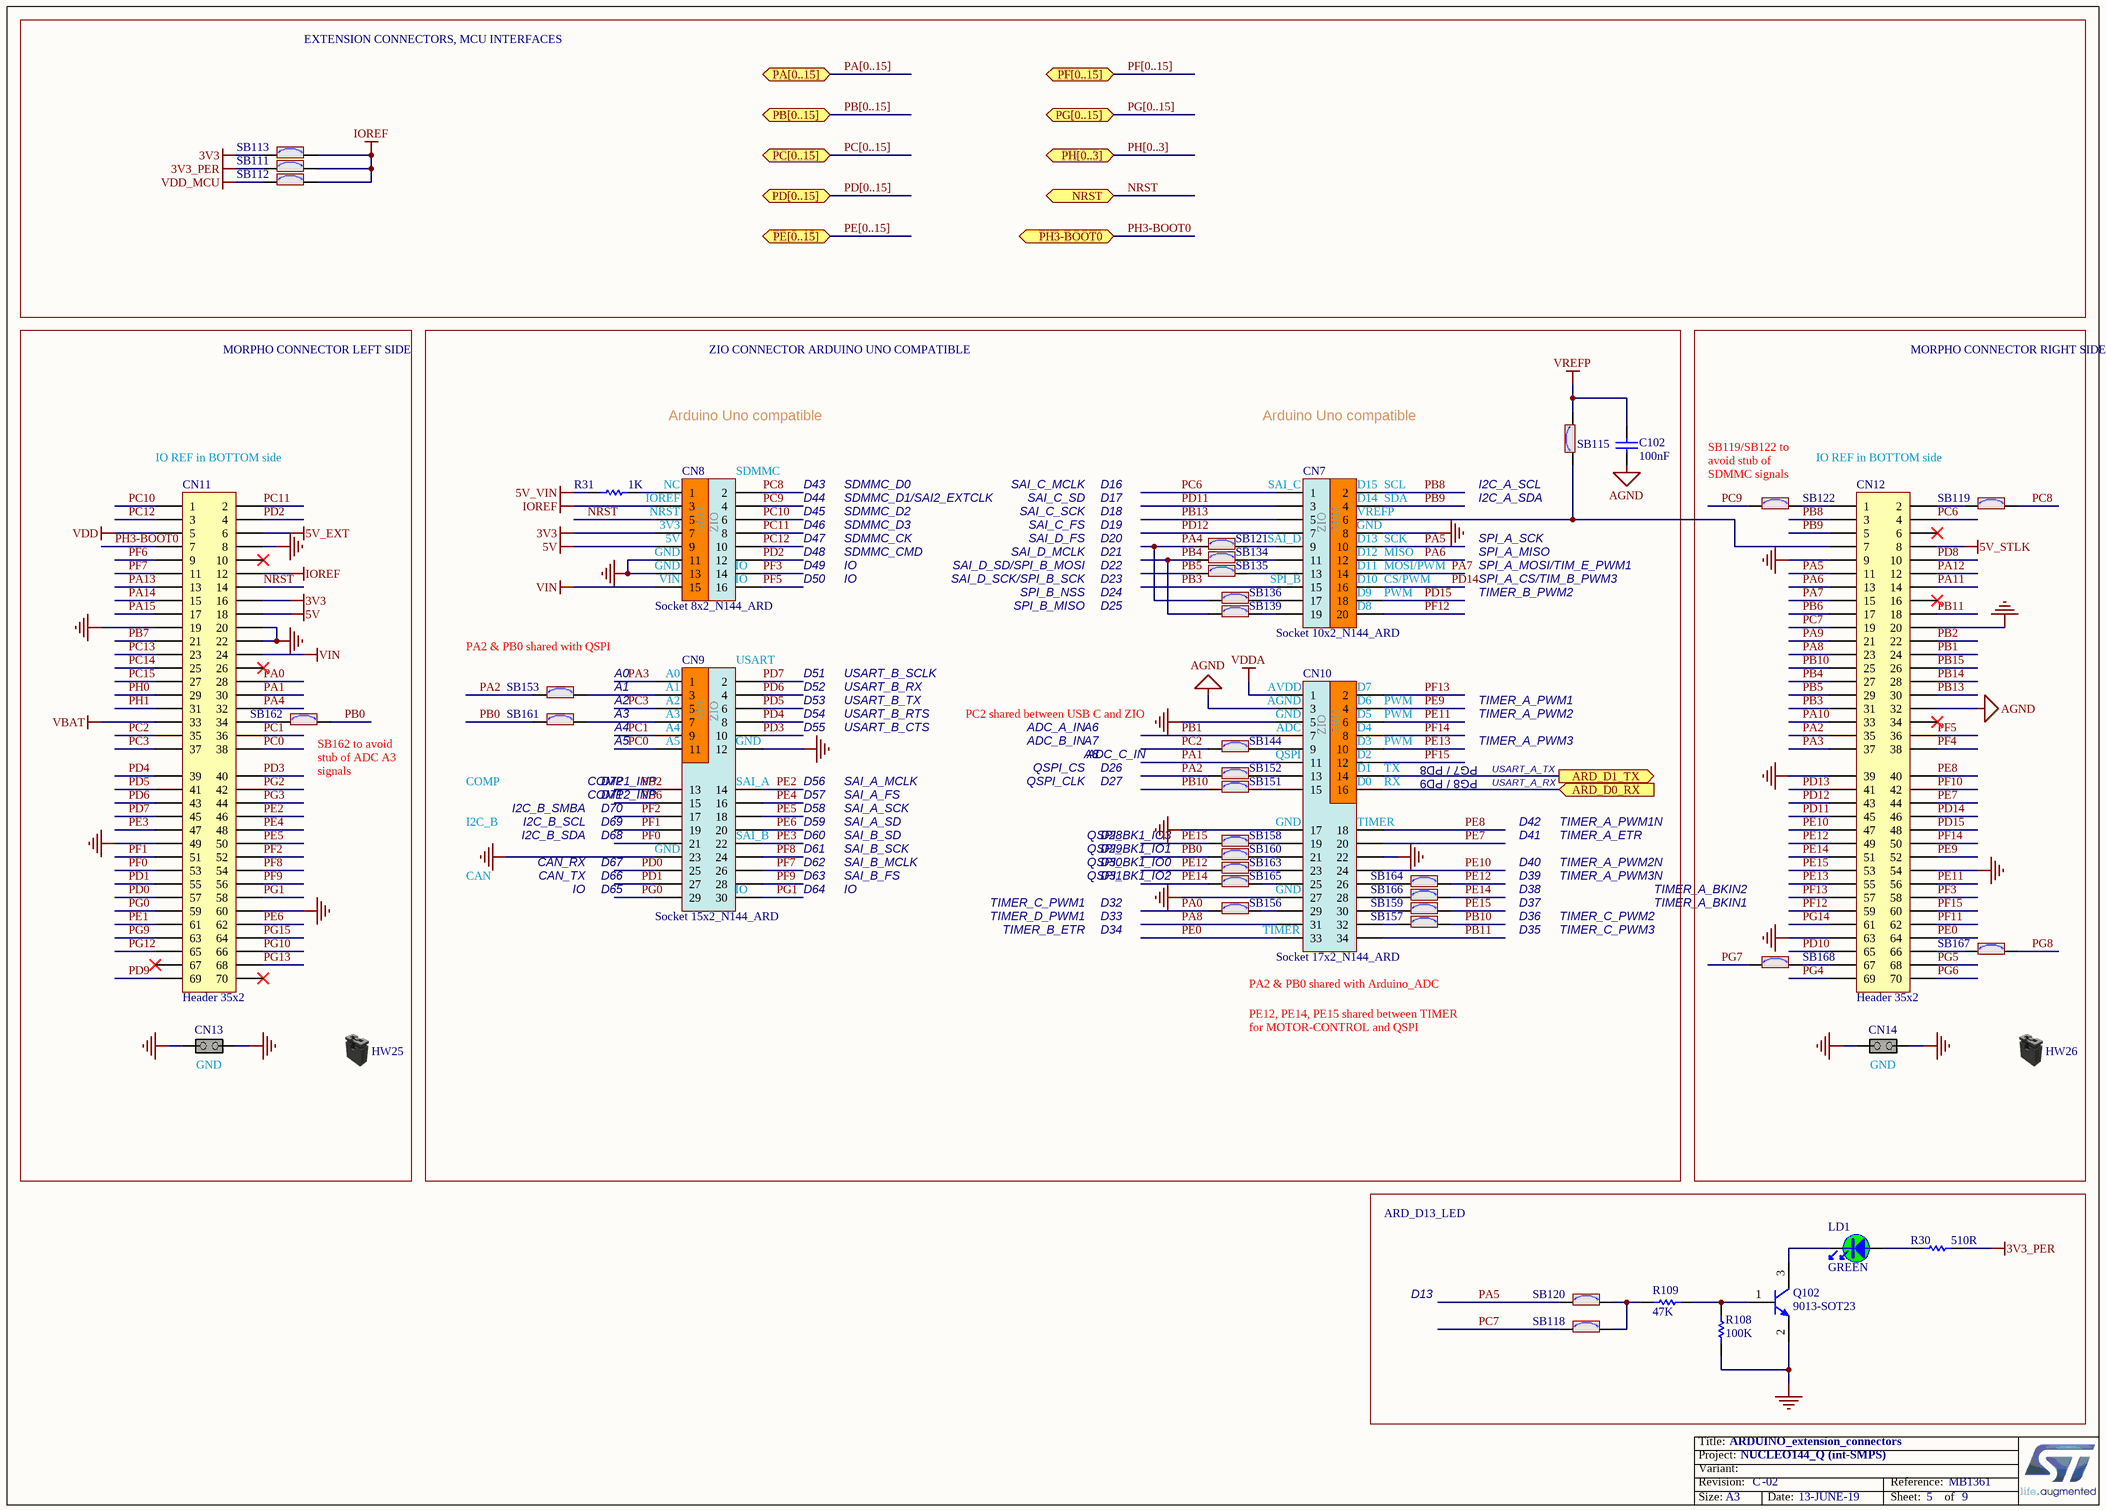
[diagram p6: ARDUINO_extension_connectors.SchDoc]

### Parts
C102  value 100nF  [C0603]
CN7  value Socket 10x2_N144_ARD  [CON_SAMTEC_SSW-110-23-X-D_N144_ARD]
CN8  value Socket 8x2_N144_ARD  [CON_SAMTEC_SSW-108-23-X-D_N144_ARD]
CN9  value Socket 15x2_N144_ARD  [CON_SAMTEC_SSW-115-23-X-D_N144_ARD]
CN10  value Socket 17x2_N144_ARD  [CON_SAMTEC_SSW-117-23-X-D_N144_ARD]
CN11  value Header 35x2  [CON_SAMTEC_TSW-135-07-X-D]
CN12  value Header 35x2  [CON_SAMTEC_TSW-135-07-X-D]
CN13  (no value)  [CON_SAMTEC_TSW-102-09-X-S]
CN14  (no value)  [CON_SAMTEC_TSW-102-09-X-S]
HW25  (no value)  (mechanical)
HW26  (no value)  (mechanical)
LD1  value GREEN  [LED_0603_GREEN]
Q102  value 9013-SOT23  [NPN_SOT23]
R30  value 510R  [R0603]
R31  value 1K  [R0603]
R108  value 100K  [R0603]
R109  value 47K  [R0603]
SB111  (no value)  [SOLDER-BRIDGE_R0603-0R]
SB112  (no value)  [SOLDER-BRIDGE_R0603-0R]
SB113  (no value)  [SOLDER-BRIDGE_R0603-0R]
SB115  (no value)  [SOLDER-BRIDGE_R0603-0R]
SB118  (no value)  [SOLDER-BRIDGE_R0603-0R]
SB119  (no value)  [SOLDER-BRIDGE_R0603-0R]
SB120  (no value)  [SOLDER-BRIDGE_R0603-0R]
SB121  (no value)  [SOLDER-BRIDGE_R0603-0R]
SB122  (no value)  [SOLDER-BRIDGE_R0603-0R]
SB134  (no value)  [SOLDER-BRIDGE_R0603-0R]
SB135  (no value)  [SOLDER-BRIDGE_R0603-0R]
SB136  (no value)  [SOLDER-BRIDGE_R0603-0R]
SB139  (no value)  [SOLDER-BRIDGE_R0603-0R]
SB144  (no value)  [SOLDER-BRIDGE_R0603-0R]
SB151  (no value)  [SOLDER-BRIDGE_R0603-0R]
SB152  (no value)  [SOLDER-BRIDGE_R0603-0R]
SB153  (no value)  [SOLDER-BRIDGE_R0603-0R]
SB156  (no value)  [SOLDER-BRIDGE_R0603-0R]
SB157  (no value)  [SOLDER-BRIDGE_R0603-0R]
SB158  (no value)  [SOLDER-BRIDGE_R0603-0R]
SB159  (no value)  [SOLDER-BRIDGE_R0603-0R]
SB160  (no value)  [SOLDER-BRIDGE_R0603-0R]
SB161  (no value)  [SOLDER-BRIDGE_R0603-0R]
SB162  (no value)  [SOLDER-BRIDGE_R0603-0R]
SB163  (no value)  [SOLDER-BRIDGE_R0603-0R]
SB164  (no value)  [SOLDER-BRIDGE_R0603-0R]
SB165  (no value)  [SOLDER-BRIDGE_R0603-0R]
SB166  (no value)  [SOLDER-BRIDGE_R0603-0R]
SB167  (no value)  [SOLDER-BRIDGE_R0603-0R]
SB168  (no value)  [SOLDER-BRIDGE_R0603-0R]

### Blocks framed on the sheet
EXTENSION CONNECTORS, MCU INTERFACES: SB111-SB113

### Ports
ARD_D0_RX (in), ARD_D1_TX (out), NRST, PA[0..15] (bidir), PB[0..15] (bidir), PC[0..15] (bidir), PD[0..15] (bidir), PE[0..15] (bidir), PF[0..15] (bidir), PG[0..15] (bidir), PH3-BOOT0, PH[0..3] (bidir)

### Nets
3V3: CN8.7 CN11.16 SB113.1
3V3_PER: R30.2 SB111.1
5V: CN8.9 CN11.18
5V_EXT: CN11.6
5V_STLK: CN12.8
5V_VIN: R31.2
AGND: C102.1 CN10.3 CN12.32
GND: CN7.8 CN8.11 CN8.13 CN9.12 CN9.23 CN10.5 CN10.17 CN10.22 CN10.27 CN11.8 CN11.19 CN11.20 CN11.22 CN11.49 CN11.60 CN12.9 CN12.20 CN12.39 CN12.54 CN12.63 CN13.1(COMMON) CN13.2(NO) CN14.1(COMMON) CN14.2(NO) Q102.2(E) R108.1
IOREF: CN8.3 CN11.12 SB111.2 SB112.2 SB113.2
VBAT: CN11.33
VDD: CN11.5
VDD_MCU: SB112.1
VDDA: CN10.1
VIN: CN8.15 CN11.24
VREFP: C102.2 SB115.2
ARD_D0_RX: CN10.16 ; port ARD_D0_RX
ARD_D1_TX: CN10.14 ; port ARD_D1_TX
NRST: CN8.5 CN11.14 ; port NRST
PA0: CN11.28 SB156.1
PA1: CN10.11 CN11.30
PA2: CN12.35 SB152.1 SB153.1
PA3: CN9.1 CN12.37
PA4: CN11.32 SB121.1 SB136.1
PA5: CN7.10 CN12.11 SB120.1
PA6: CN7.12 CN12.13
PA7: CN7.14 CN12.15
PA8: CN10.31 CN12.23
PA9: CN12.21
PA10: CN12.33
PA11: CN12.14
PA12: CN12.12
PA13: CN11.13
PA14: CN11.15
PA15: CN11.17
PB0: SB160.1 SB161.1 SB162.2
PB1: CN10.7 CN12.24
PB2: CN9.13 CN12.22
PB3: CN7.15 CN12.31
PB4: CN12.27 SB134.1 SB139.1
PB5: CN12.29 SB135.1
PB6: CN9.15 CN12.17
PB7: CN11.21
PB8: CN7.2 CN12.3
PB9: CN7.4 CN12.5
PB10: CN12.25 SB151.1 SB157.2
PB11: CN10.34 CN12.18
PB13: CN7.5 CN12.30
PB14: CN12.28
PB15: CN12.26
PC0: CN9.11 CN11.38
PC1: CN9.9 CN11.36
PC2: CN11.35 SB144.1
PC3: CN9.5 CN11.37
PC6: CN7.1 CN12.4
PC7: CN12.19 SB118.1
PC8: CN8.2 SB119.2
PC9: CN8.4 SB122.1
PC10: CN8.6 CN11.1
PC11: CN8.8 CN11.2
PC12: CN8.10 CN11.3
PC13: CN11.23
PC14: CN11.25
PC15: CN11.27
PD0: CN9.25 CN11.57
PD1: CN9.27 CN11.55
PD2: CN8.12 CN11.4
PD3: CN9.10 CN11.40
PD4: CN9.8 CN11.39
PD5: CN9.6 CN11.41
PD6: CN9.4 CN11.43
PD7: CN9.2 CN11.45
PD8: CN12.10
PD9: CN11.69
PD10: CN12.65
PD11: CN7.3 CN12.45
PD12: CN7.7 CN12.43
PD13: CN12.41
PD14: CN7.16 CN12.46
PD15: CN7.18 CN12.48
PE0: CN10.33 CN12.64
PE1: CN11.61
PE2: CN9.14 CN11.46
PE3: CN9.22 CN11.47
PE4: CN9.16 CN11.48
PE5: CN9.18 CN11.50
PE6: CN9.20 CN11.62
PE7: CN10.20 CN12.44
PE8: CN10.18 CN12.40
PE9: CN10.4 CN12.52
PE10: CN10.24 CN12.47
PE11: CN10.6 CN12.56
PE12: CN12.49 SB163.1 SB164.2
PE13: CN10.10 CN12.55
PE14: CN12.51 SB165.1 SB166.2
PE15: CN12.53 SB158.1 SB159.2
PF0: CN9.21 CN11.53
PF1: CN9.19 CN11.51
PF2: CN9.17 CN11.52
PF3: CN8.14 CN12.58
PF4: CN12.38
PF5: CN8.16 CN12.36
PF6: CN11.9
PF7: CN9.26 CN11.11
PF8: CN9.24 CN11.54
PF9: CN9.28 CN11.56
PF10: CN12.42
PF11: CN12.62
PF12: CN7.20 CN12.59
PF13: CN10.2 CN12.57
PF14: CN10.8 CN12.50
PF15: CN10.12 CN12.60
PG0: CN9.29 CN11.59
PG1: CN9.30 CN11.58
PG2: CN11.42
PG3: CN11.44
PG4: CN12.69
PG5: CN12.68
PG6: CN12.70
PG7: SB168.1
PG8: SB167.2
PG9: CN11.63
PG10: CN11.66
PG12: CN11.65
PG13: CN11.68
PG14: CN12.61
PG15: CN11.64
PH0: CN11.29
PH1: CN11.31
PH3-BOOT0: CN11.7 ; port PH3-BOOT0
NetCN7_6: CN7.6 CN12.7 SB115.1
NetCN7_9: CN7.9 SB121.2
NetCN7_11: CN7.11 SB134.2
NetCN7_13: CN7.13 SB135.2
NetCN7_17: CN7.17 SB136.2
NetCN7_19: CN7.19 SB139.2
NetCN8_1: CN8.1 R31.1
NetCN9_3: CN9.3 SB153.2
NetCN9_7: CN9.7 SB161.2
NetCN10_9: CN10.9 SB144.2
NetCN10_13: CN10.13 SB152.2
NetCN10_15: CN10.15 SB151.2
NetCN10_19: CN10.19 SB158.2
NetCN10_21: CN10.21 SB160.2
NetCN10_23: CN10.23 SB163.2
NetCN10_25: CN10.25 SB165.2
NetCN10_26: CN10.26 SB164.1
NetCN10_28: CN10.28 SB166.1
NetCN10_29: CN10.29 SB156.2
NetCN10_30: CN10.30 SB159.1
NetCN10_32: CN10.32 SB157.1
NetCN11_34: CN11.34 SB162.1
NetCN12_1: CN12.1 SB122.2
NetCN12_2: CN12.2 SB119.1
NetCN12_66: CN12.66 SB167.1
NetCN12_67: CN12.67 SB168.2
NetLD1_1: LD1.1 R30.1
NetLD1_2: LD1.2 Q102.3(C)
NetQ102_1: Q102.1(B) R108.2 R109.2
NetR109_1: R109.1 SB118.2 SB120.2

Not connected (* = marked no-connect by the designer): CN11 10* 26* 67* 70*; CN12 6* 16* 34*

### Buses and harness runs
bus PA[0..15] = port PA[0..15]
bus PB[0..15] = port PB[0..15]
bus PC[0..15] = port PC[0..15]
bus PD[0..15] = port PD[0..15]
bus PE[0..15] = port PE[0..15]
bus PF[0..15] = port PF[0..15]
bus PG[0..15] = port PG[0..15]
bus PH[0..3] = port PH[0..3]

### Notes on the sheet
- MORPHO CONNECTOR LEFT SIDE
- ZIO CONNECTOR ARDUINO UNO COMPATIBLE
- MORPHO CONNECTOR RIGHT SIDE
- Arduino Uno compatible
- (near CN11) IO REF in BOTTOM side
- (near CN8) NC
- (near CN8) IOREF
- (near CN8) NRST
- (near CN8) SDMMC
- D43
- D44
- D45
- SDMMC_D0
- SDMMC_D1/SAI2_EXTCLK
- SDMMC_D2
- SAI_C_SD
- SAI_C_SCK
- SAI_C_MCLK
- D16
- D17
- D18
- (near CN7) SAI_C
- (near CN7) VREFP
- (near CN7) D14
- (near CN7) D15
- (near CN7) SCL
- (near CN7) SDA
- (near SB115) I2C_A_SCL
- I2C_A_SDA
- (near SB122) SB119/SB122 to avoid stub of SDMMC signals
- IO REF in BOTTOM side
- (near CN8) 3V3
- (near CN8) 5V
- (near CN8) GND
- (near CN8) VIN
- (near CN8) IO
- D46
- D47
- D48
- D49
- D50
- SDMMC_CK
- SDMMC_CMD
- SDMMC_D3
- IO
- SAI_C_FS
- SAI_D_SD/SPI_B_MOSI
- SAI_D_SCK/SPI_B_SCK
- SAI_D_FS
- SAI_D_MCLK
- D19
- D20
- D21
- D22
- D23
- (near CN7) SPI_B
- (near CN7) SAI_D
- (near CN7) D10
- (near CN7) D11
- (near CN7) D12
- (near CN7) D13
- (near CN7) SCK
- (near CN7) GND
- (near CN7) MISO
- (near CN7) MOSI/PWM
- (near CN7) CS/PWM
- SPI_A_CS/TIM_B_PWM3
- SPI_A_MOSI/TIM_E_PWM1
- SPI_A_SCK
- SPI_A_MISO
- PA2 & PB0 shared with QSPI
- SPI_B_MISO
- SPI_B_NSS
- D24
- D25
- (near CN7) D8
- (near CN7) D9
- (near CN7) PWM
- TIMER_B_PWM2
- A0
- A1
- A2
- A3
- (near CN9) A0
- (near CN9) A1
- (near CN9) A2
- (near CN9) A3
- (near CN9) USART
- D51
- D52
- D53
- D54
- USART_B_TX
- USART_B_RX
- USART_B_SCLK
- USART_B_RTS
- PC2 shared between USB C and ZIO
- (near CN10) GND
- (near CN10) AVDD
- (near CN10) AGND
- (near CN10) D7
- (near CN10) D6
- (near CN10) D5
- (near CN10) PWM
- TIMER_A_PWM1
- TIMER_A_PWM2
- (near SB162) SB162 to avoid stub of ADC A3 signals
- COMP
- COMP1_INP
- D72
- A4
- A5
- (near CN9) A4
- (near CN9) A5
- (near CN9) SAI_A
- (near CN9) GND
- D55
- D56
- SAI_A_MCLK
- USART_B_CTS
- QSPI_CLK
- QSPI_CS
- ADC_A_IN
- ADC_B_IN
- ADC_C_IN
- A6
- A7
- A8
- D26
- D27
- (near CN10) ADC
- (near CN10) QSPI
- (near CN10) D2
- (near CN10) D4
- (near CN10) D3
- (near CN10) D1
- (near CN10) D0
- (near CN10) TX
- (near CN10) RX
- TIMER_A_PWM3
- PG8 / PD9
- PG7 / PD8
- USART_A_TX
- USART_A_RX
- I2C_B
- I2C_B_SCL
- I2C_B_SDA
- I2C_B_SMBA
- COMP2_INP
- D71
- D70
- D69
- D68
- (near CN9) SAI_B
- D57
- D58
- D59
- D60
- D61
- SAI_A_SD
- SAI_A_SCK
- SAI_A_FS
- SAI_B_SD
- SAI_B_SCK
- QSPI_BK1_IO1
- QSPI_BK1_IO3
- D28
- D29
- (near CN10) TIMER
- D41
- D42
- TIMER_A_PWM1N
- TIMER_A_ETR
- CAN
- CAN_TX
- CAN_RX
- D67
- D66
- D65
- (near CN9) IO
- D62
- D63
- D64
- SAI_B_FS
- SAI_B_MCLK
- TIMER_D_PWM1
- TIMER_C_PWM1
- QSPI_BK1_IO0
- QSPI_BK1_IO2
- D30
- D31
- D32
- D33
- D36
- D37
- D38
- D39
- D40
- TIMER_A_PWM2N
- TIMER_A_PWM3N
- TIMER_C_PWM2
- TIMER_A_BKIN1
- TIMER_A_BKIN2
- TIMER_B_ETR
- D34
- PA2 & PB0 shared with Arduino_ADC
- TIMER
- D35
- TIMER_C_PWM3
- PE12, PE14, PE15 shared between TIMER for MOTOR-CONTROL and QSPI
- (near CN13) GND
- (near CN14) GND
- ARD_D13_LED
- D13
- Title:
- Project:
- Size:
- Revision:
- Variant:
- -
- Date:
- Reference:
- Sheet:
- of
- (in symbol MCD-01037) ARD; ZIO
- (in symbol MCD-01039) ZIO; ARD
- (in symbol MCD-01040) ARD; ZIO
- (in symbol MCD-01041) ZIO; ARD

### Library data of the parts
C102 = MCD-00211: Capacitor, MLCC, 100nF, 16V, X7R, 10%, 0603, T=0,8mm; Manufacturer_Part_Number: CC0603KRX7R7BB104; Manufacturer: YAGEO; Provided_By: Subcon; Initial_Board_Reference: MB1319; Internal_Part_Number: MCD-00211; ECCN_US: n/a; ECCN_EU: n/a; ComponentLink1Description: Datasheet; Status: Released; Part_Type: Capacitor; Package: C0603; ComponentLink1URL: http://tunmcdsvn.tun.st.com/Component_Datasheet_Library/Trunk/Capacitors/Yageo_Multilayer_Capacitor_X7R_series_100pF_to_22uF
CN7 = MCD-01039: Socket, 10x2, 2.54mm, VR, TH, Height 8.51mm/10mm, Low insertion force.; Part_Type: Connector; Manufacturer_Part_Number: SSW-110-23-x-D; Manufacturer: SAMTEC; Provided_By: Subcon; Initial_Board_Reference: MB1361; Remark: Socket dedicated to Arduino+ZIO connector on NUCLEO144; Internal_Part_Number: MCD-01039; Status: Checked; ComponentLink1Description: Datasheet; ComponentLink1URL: http://tunmcdsvn.tun.st.com/Component_Datasheet_Library/Trunk/Connectors/Samtec_SSW-SSQ-series; ECCN_US: n/a; ECCN_EU: n/a
CN8 = MCD-01037: Socket, 8x2, 2.54mm, VR, TH, Height 8.51mm/10mm, Low insertion force.; Part_Type: Connector; Manufacturer_Part_Number: SSW-108-23-x-D; Manufacturer: SAMTEC; Provided_By: Subcon; Initial_Board_Reference: MB1361; Remark: Socket dedicated to Arduino+ZIO connector on NUCLEO144; Internal_Part_Number: MCD-01037; Status: Checked; ComponentLink1Description: Datasheet; ComponentLink1URL: http://tunmcdsvn.tun.st.com/Component_Datasheet_Library/Trunk/Connectors/Samtec_SSW-SSQ-series; ECCN_US: n/a; ECCN_EU: n/a
CN9 = MCD-01040: Socket, 15x2, 2.54mm, VR, TH, Height 8.51mm/10mm, Low insertion force.; Part_Type: Connector; Manufacturer_Part_Number: SSW-115-23-x-D; Manufacturer: SAMTEC; Provided_By: Subcon; Initial_Board_Reference: MB1361; Remark: Socket dedicated to Arduino+ZIO connector on NUCLEO144; Internal_Part_Number: MCD-01040; Status: Checked; ComponentLink1Description: Datasheet; ComponentLink1URL: http://tunmcdsvn.tun.st.com/Component_Datasheet_Library/Trunk/Connectors/Samtec_SSW-SSQ-series; ECCN_US: n/a; ECCN_EU: n/a
CN10 = MCD-01041: Socket, 17x2, 2.54mm, VR, TH, Height 8.51mm/10mm, Low insertion force; Part_Type: Connector; Manufacturer_Part_Number: SSW-117-23-x-D; Manufacturer: SAMTEC; Provided_By: Subcon; Initial_Board_Reference: MB1361; Remark: Socket dedicated to Arduino+ZIO connector on NUCLEO144; Internal_Part_Number: MCD-01041; Status: Checked; ComponentLink1Description: Datasheet; ComponentLink1URL: http://tunmcdsvn.tun.st.com/Component_Datasheet_Library/Trunk/Connectors/Samtec_SSW-SSQ-series; ECCN_US: n/a; ECCN_EU: n/a
CN11 CN12 = MCD-01210: Header, 35x2, 2,54mm, VR, TH, Height 5.84mm/2.54mm; Part_Type: Connector; Manufacturer_Part_Number: TSW-135-07-x-D; Manufacturer: SAMTEC; Provided_By: Subcon; Initial_Board_Reference: MB1361; Internal_Part_Number: MCD-01210; Status: Checked; ComponentLink1Description: Datasheet; ComponentLink1URL: http://tunmcdsvn.tun.st.com/Component_Datasheet_Library/Trunk/Connectors/Samtec_TSW-HTSW-series; ECCN_US: n/a; ECCN_EU: n/a
CN13 CN14 = MCD-00214: Header, 2x1, 2,54mm, VR, TH, Height 5.84mm/10.16mm; Manufacturer_Part_Number: TSW-102-09-x-S; Manufacturer: SAMTEC; Part_Type: Connector; Value: Header 2x1 16mm; Provided_By: Subcon; Initial_Board_Reference: MB1319; Internal_Part_Number: MCD-00214; ECCN_US: n/a; ECCN_EU: n/a; ComponentLink1Description: Datasheet; Status: Released; ComponentLink1URL: http://tunmcdsvn.tun.st.com/Component_Datasheet_Library/Trunk/Connectors/Samtec_TSW-HTSW-series
HW25 HW26 = MCD-00043: SHUNT 2.54mm BLACK; Manufacturer_Part_Number: SNT-100-BK-G; Manufacturer: SAMTEC; Part_Type: Mechanical; Provided_By: Subcon; Initial_Board_Reference: MB1274; Internal_Part_Number: MCD-00043; ECCN_US: n/a; ECCN_EU: n/a; ComponentLink1Description: Datasheet; Status: Released; ComponentLink1URL: http://tunmcdsvn.tun.st.com/Component_Datasheet_Library/Trunk/Connectors/Samtec_Shunt_Jumper_SNT100
LD1 = MCD-00050: LED, Green, 0603; Part_Type: Display; Manufacturer_Part_Number: 19-213SYGC/S530-E2/TR8; Manufacturer: EVERLIGHT; ECCN_US: EAR99; ECCN_EU: NEC; Provided_By: Subcon; Initial_Board_Reference: MB1274; Internal_Part_Number: MCD-00050; Status: Released; ComponentLink1Description: Datasheet; Package: LED 0603; ComponentLink1URL: http://tunmcdsvn.tun.st.com/Component_Datasheet_Library/Trunk/Display/Everlight_SMD-LED-GREEN_19-213SYGC-S530-XX-TR8-v3.doc
Q102 = MCD-00073: NPN Bipolar Transistor; Part_Type: IC; Manufacturer_Part_Number: BSR14; Manufacturer: NXP; ECCN_US: EAR99; ECCN_EU: NEC; Provided_By: Subcon; Initial_Board_Reference: MB1274; Revision: *; Internal_Part_Number: MCD-00073; Status: Released; ComponentLink1Description: Datasheet; ComponentLink1URL: http://tunmcdsvn.tun.st.com/Component_Datasheet_Library/Trunk/IC/NXP_Transistor_BSR14
R30 = MCD-00225: Resistor,510R,0603,1%,1/10W; Manufacturer_Part_Number: RC0603FR-07510RL; Manufacturer: YAGEO; Provided_By: Subcon; Initial_Board_Reference: MB1319; Internal_Part_Number: MCD-00225; Status: Released; Part_Type: Resistor; ComponentLink1Description: Datasheet; ECCN_US: n/a; ECCN_EU: n/a; Package: R0603; ComponentLink1URL: http://tunmcdsvn.tun.st.com/Component_Datasheet_Library/Trunk/Resistors/Yageo_Resistor_RC0603-series
R31 = MCD-00070: Resistor,1K,0603,1%,1/10W; Manufacturer_Part_Number: RC0603FR-071KL; Manufacturer: YAGEO; Provided_By: Subcon; Initial_Board_Reference: MB1274; Internal_Part_Number: MCD-00070; ECCN_US: n/a; ECCN_EU: n/a; ComponentLink1Description: Datasheet; Status: Released; Part_Type: Resistor; Package: R0603; ComponentLink1URL: http://tunmcdsvn.tun.st.com/Component_Datasheet_Library/Trunk/Resistors/Yageo_Resistor_RC0603-series
R108 = MCD-00223: Resistor,100K,0603,1%,1/10W; Manufacturer_Part_Number: RC0603FR-07100KL; Manufacturer: YAGEO; Provided_By: Subcon; Initial_Board_Reference: MB1319; Internal_Part_Number: MCD-00223; Status: Released; Part_Type: Resistor; ComponentLink1Description: Datasheet; ECCN_US: n/a; ECCN_EU: n/a; Package: R0603; ComponentLink1URL: http://tunmcdsvn.tun.st.com/Component_Datasheet_Library/Trunk/Resistors/Yageo_Resistor_RC0603-series
R109 = MCD-00222: Resistor,47K,0603,1%,1/10W; Manufacturer_Part_Number: RC0603FR-0747KL; Manufacturer: YAGEO; Provided_By: Subcon; Initial_Board_Reference: MB1319; Internal_Part_Number: MCD-00222; Status: Released; Part_Type: Resistor; ComponentLink1Description: Datasheet; ECCN_US: n/a; ECCN_EU: n/a; Package: R0603; ComponentLink1URL: http://tunmcdsvn.tun.st.com/Component_Datasheet_Library/Trunk/Resistors/Yageo_Resistor_RC0603-series
SB111-SB113 SB115 SB118-SB122 SB134-SB136 SB139 SB144 SB151-SB153 SB156-SB168 = MCD-00071: Solder Bridge ON; Part_Type: Mechanical; Provided_By: Subcon; Initial_Board_Reference: MB1274; Internal_Part_Number: MCD-00071; ECCN_US: n/a; ECCN_EU: n/a; Status: Released; ComponentLink1Description: Datasheet